# Altium schematic sheet Badbird5907_deltaboard__PCB_Components__XDMK-12C01-251_XDMK-12C01-25.schdoc
size 127 x 101 mm
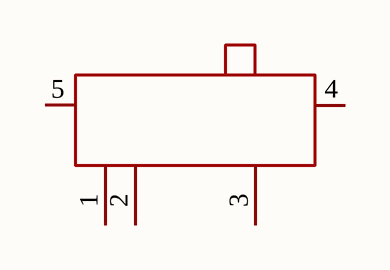
[diagram p0: Badbird5907_deltaboard__PCB_Components__XDMK-12C01-251_XDMK-12C01-25.schdoc]

## Parts
SW?  XDMK-12C01-25  [SW-SMD_XDMK-12C01-25]  (value not drawn)

## Nets

Not connected (* = marked no-connect by the designer): SW? 1 2 3 4 5

## Library data of the parts
SW? = XDMK-12C01-25: Manufacturer: LX(连欣科技); Add into BOM: yes; Circuit: SPST; Voltage Rating: 12V; Symbol: XDMK-12C01-25; Device: XDMK-12C01-25; LCSC Part Name: 7脚拨动开关 二挡7脚拨动卧式贴片; Supplier Part: C7498220; Manufacturer Part: XDMK-12C01-25; Supplier Footprint: SMD; JLCPCB Part Class: Extended Part; Datasheet: https://atta.szlcsc.com/upload/public/pdf/source/20230825/2E14AD552E80A107BA31E3CCD9245811.pdf; Supplier: LCSC; Convert to PCB: yes; Actuator Style: -; Pin Style: -; Switch Length: -; Switch Width: -; Switch Height: -; Mounting Style: Standing paste; Actuator Color: -; Current Rating: -; Mechanical Life: -; Operating Temperature: -